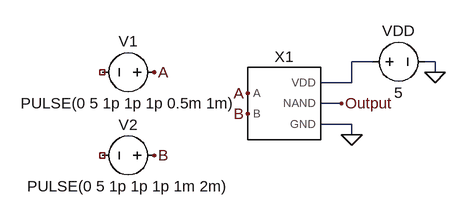
[diagram p0: schematic NAND_block.asc]
NAND_block.asc, the LTspice schematic file:
Version 4
SHEET 1 880 680
WIRE 336 80 304 80
WIRE 432 80 416 80
WIRE 432 96 432 80
WIRE 304 112 304 80
WIRE 304 112 256 112
WIRE 288 144 256 144
WIRE 304 176 256 176
WIRE 304 192 304 176
FLAG 304 192 0
FLAG 432 96 0
FLAG 288 144 Output
FLAG 0 96 A
FLAG 144 128 A
FLAG 0 224 B
FLAG 144 160 B
SYMBOL nand 192 144 R0
SYMATTR InstName X1
SYMBOL voltage 16 96 R90
WINDOW 0 -32 56 VBottom 2
WINDOW 3 32 56 VTop 2
WINDOW 123 0 0 Left 0
WINDOW 39 0 0 Left 0
SYMATTR InstName V1
SYMATTR Value PULSE(0 5 1p 1p 1p 0.5m 1m)
SYMBOL voltage 16 224 R90
WINDOW 0 -32 56 VBottom 2
WINDOW 3 32 56 VTop 2
WINDOW 123 0 0 Left 0
WINDOW 39 0 0 Left 0
SYMATTR InstName V2
SYMATTR Value PULSE(0 5 1p 1p 1p 1m 2m)
SYMBOL voltage 320 80 R270
WINDOW 0 32 56 VTop 2
WINDOW 3 -32 56 VBottom 2
WINDOW 123 0 0 Left 0
WINDOW 39 0 0 Left 0
SYMATTR InstName VDD
SYMATTR Value 5

The netlist it stands for:
* NAND_block.asc
XX1 A B 0 Output N001 nand  ; pins A B GND NAND VDD
V1 A NC_01 PULSE(0 5 1p 1p 1p 0.5m 1m)
V2 B NC_02 PULSE(0 5 1p 1p 1p 1m 2m)
VDD N001 0 5
.backanno
.end